# EAGLE board Nava_v1.02 (EAGLE 6.1), part 1 of 5
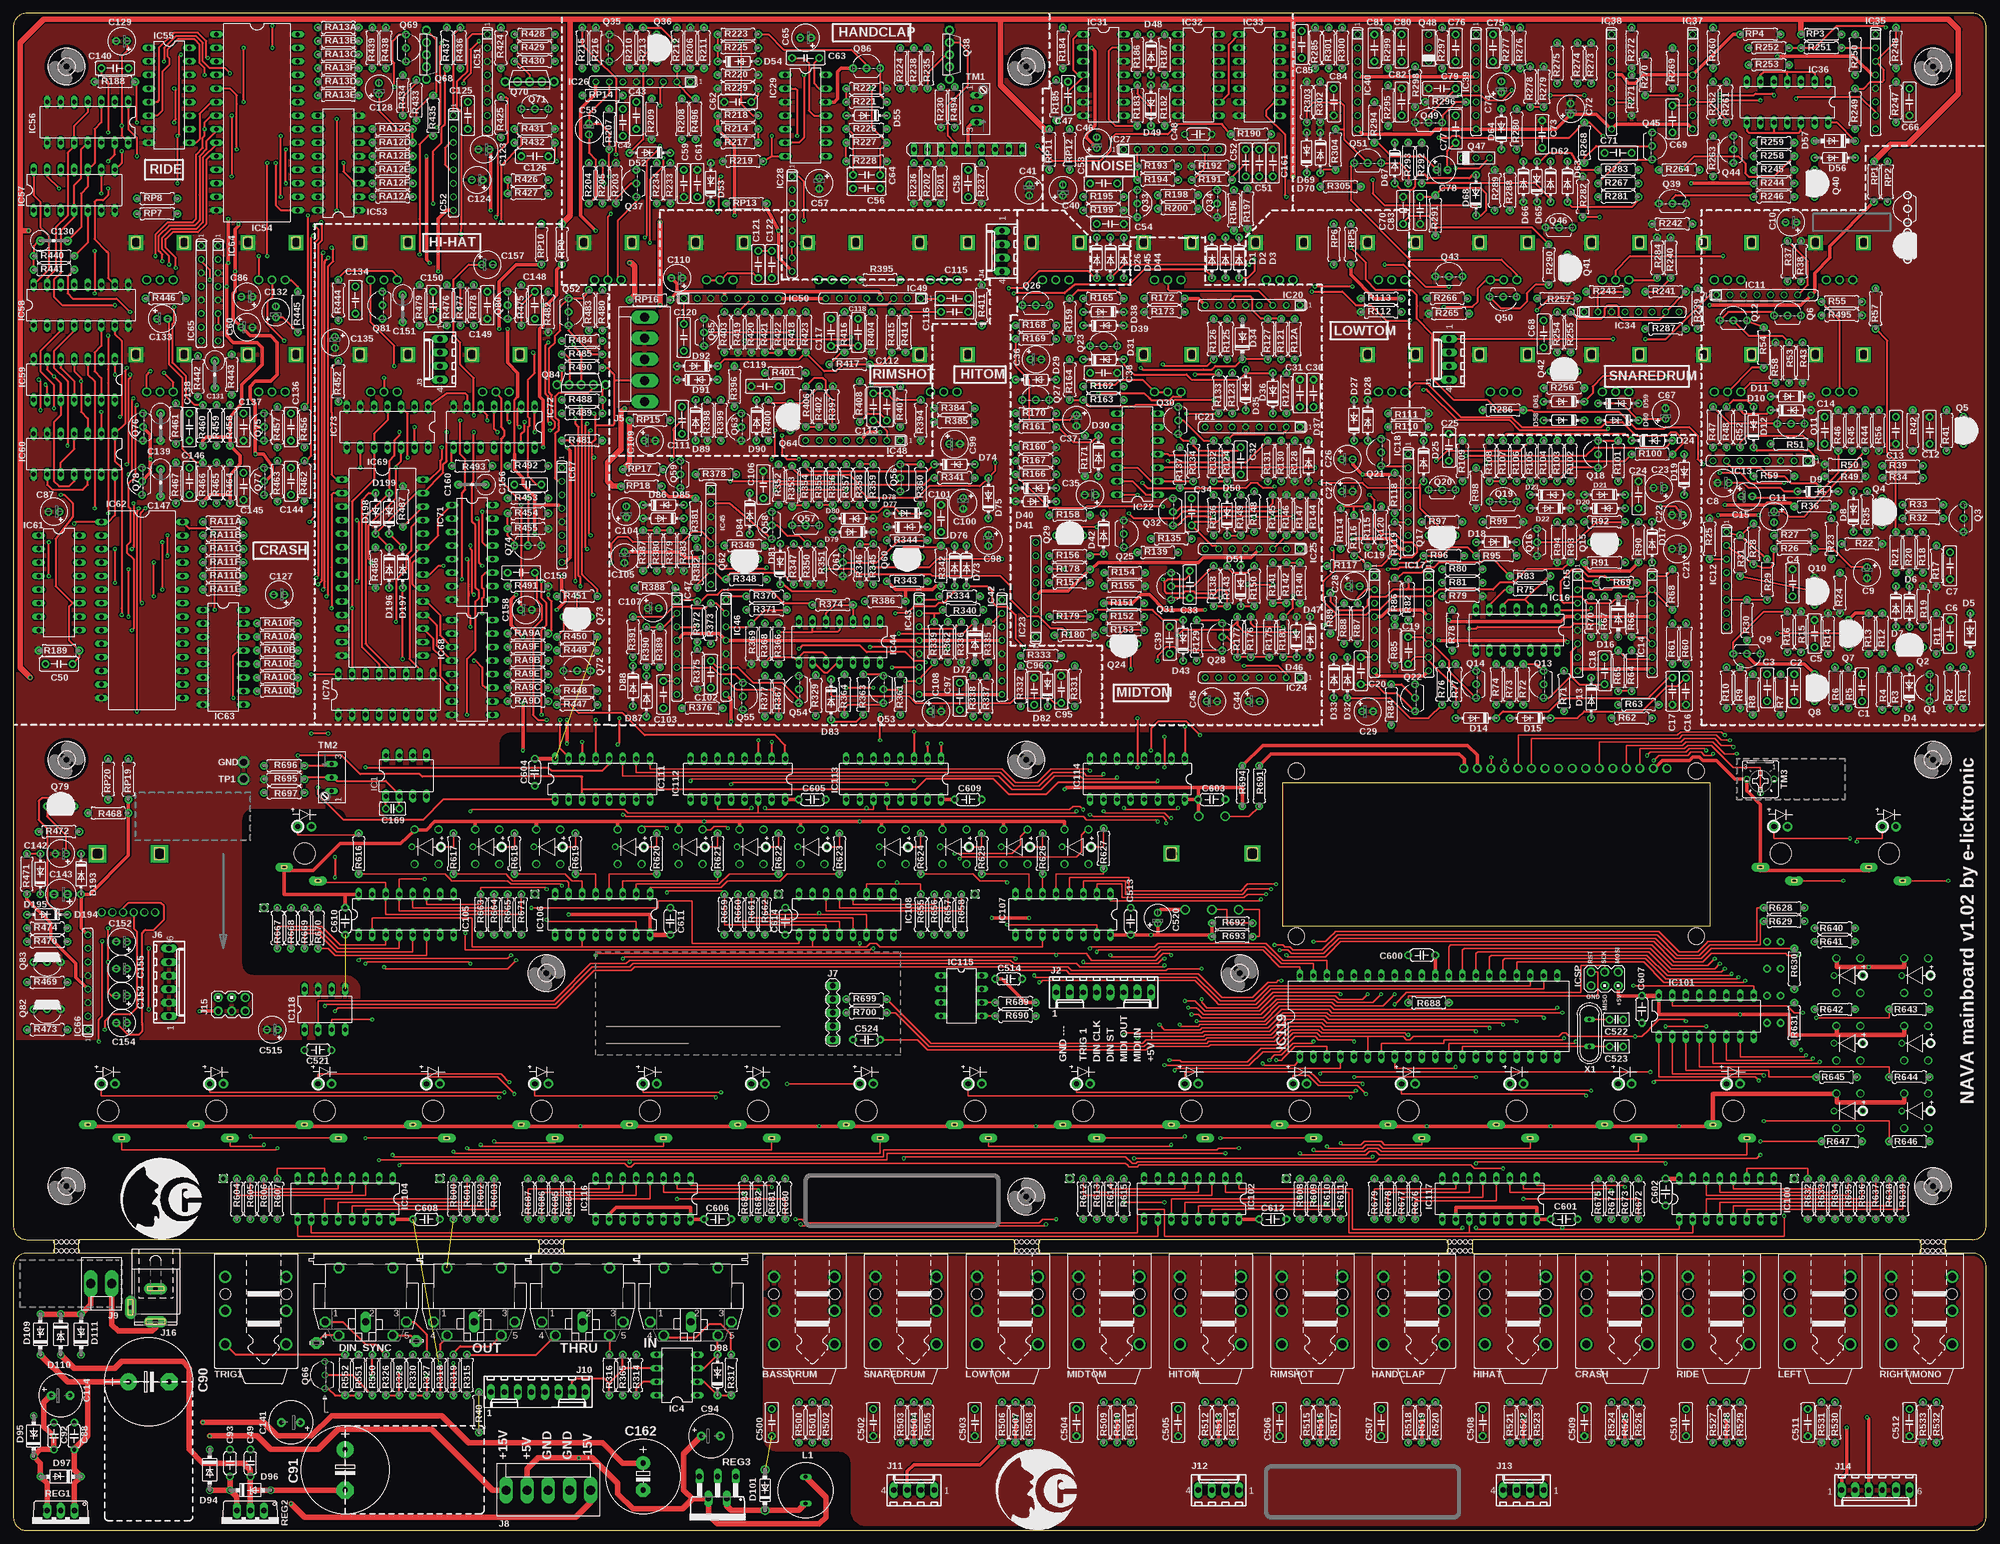
[diagram p15: board, top side]
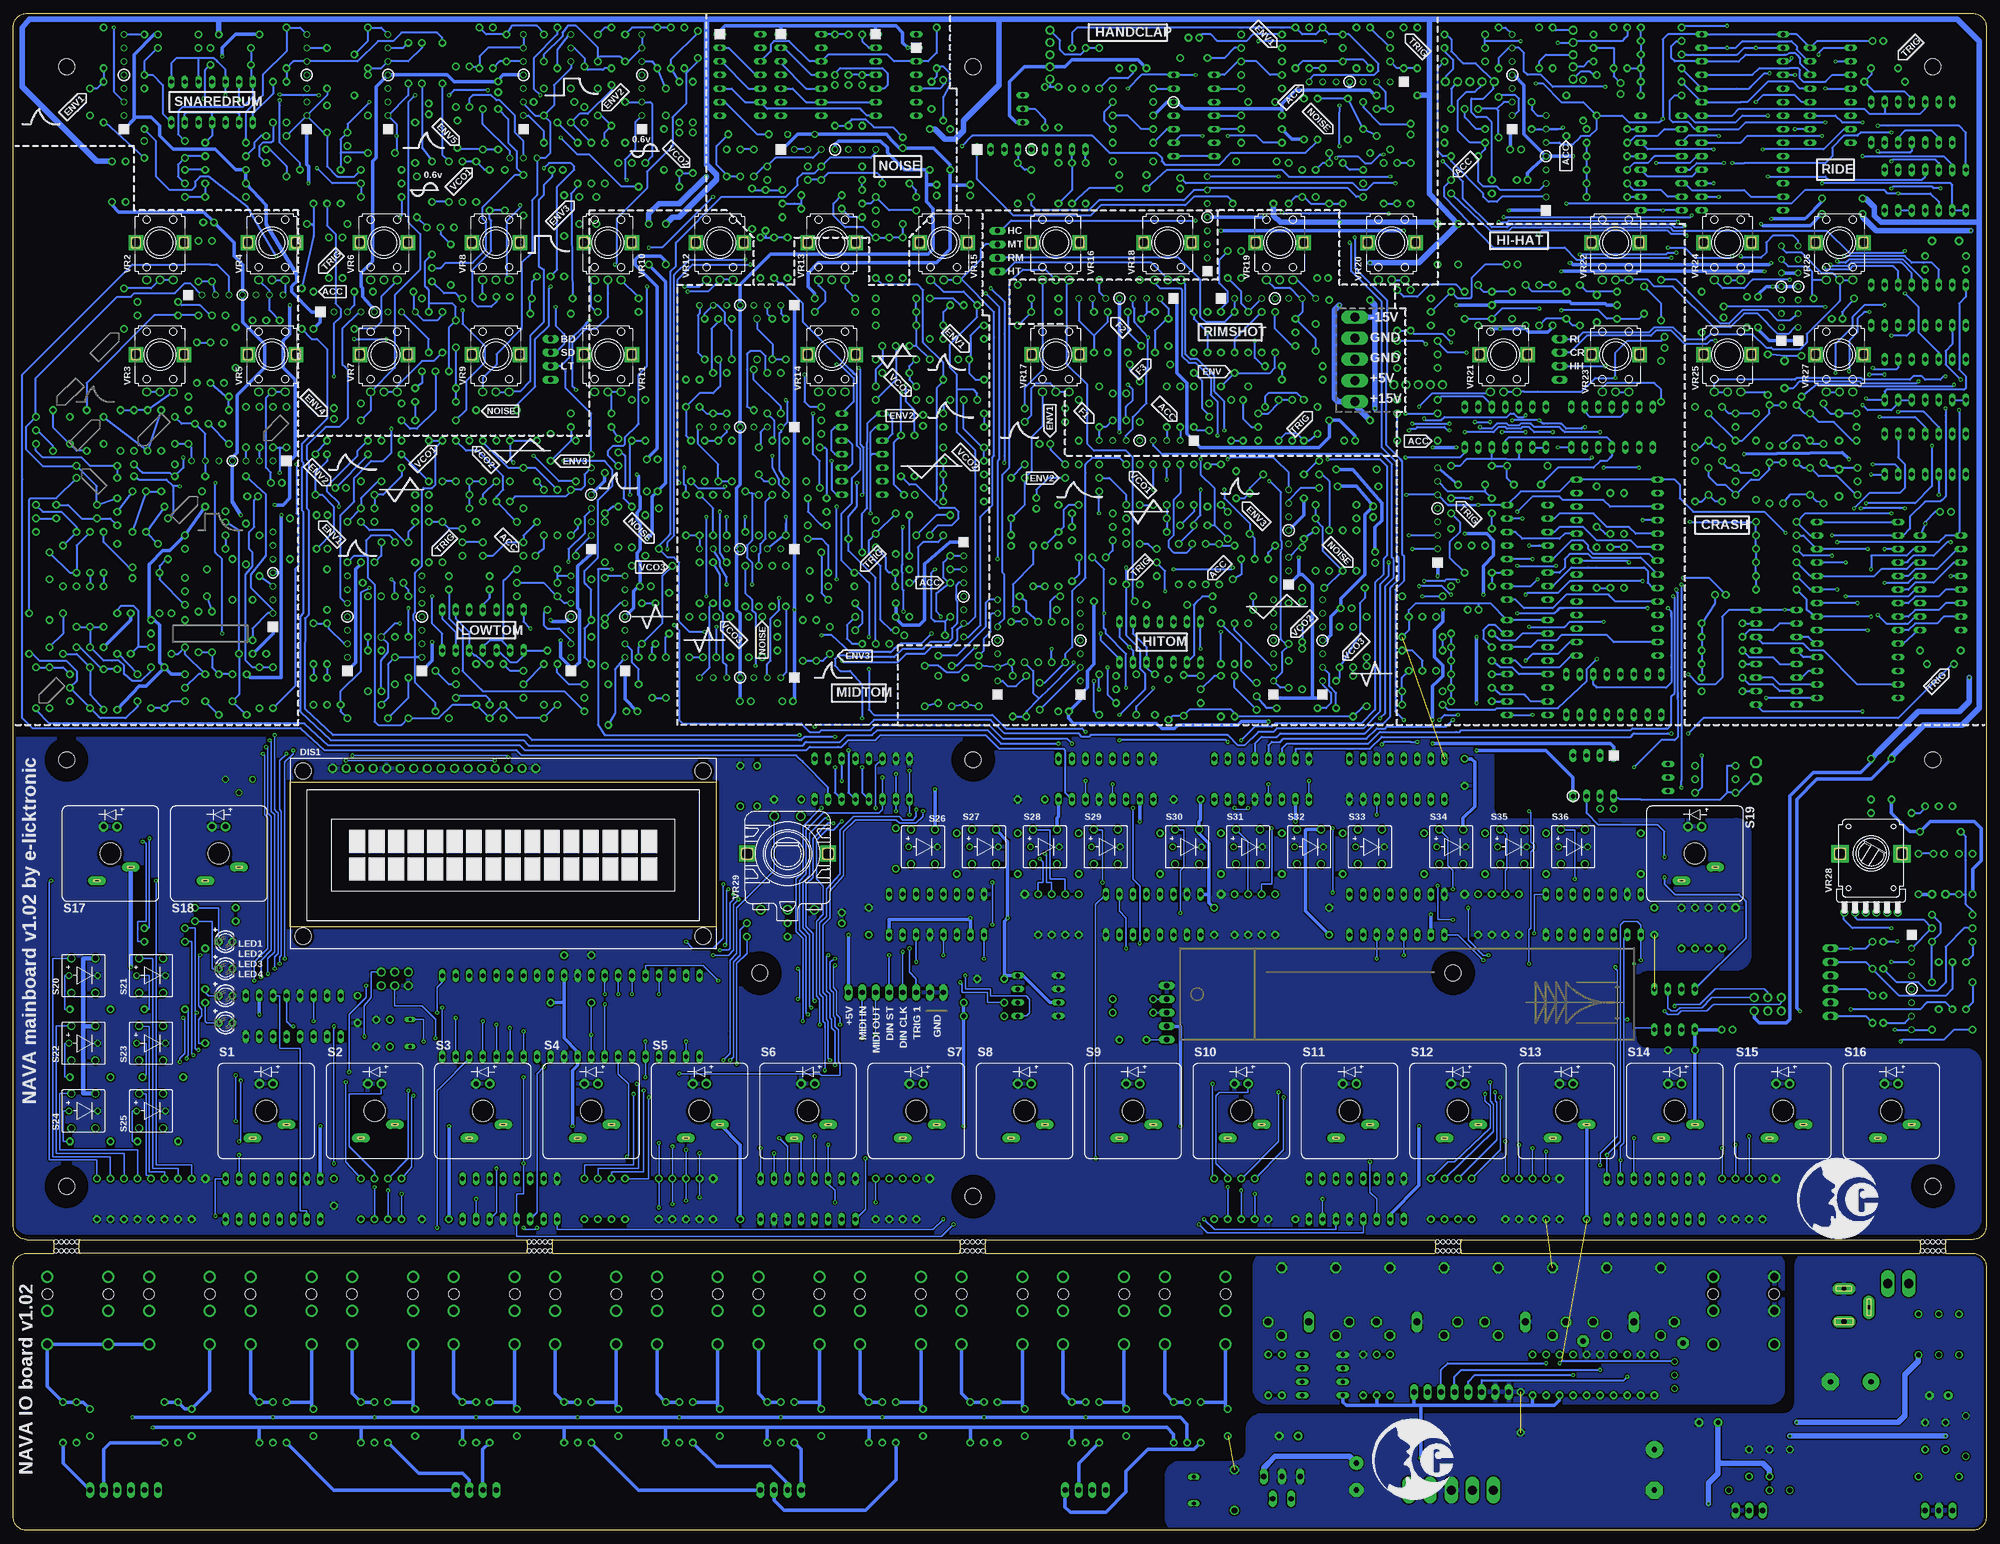
[diagram p16: board, bottom side, seen from below]

Size 370 x 284.55 mm. Coordinates in mm from the lower left corner, seen from the top.
Outline: 0,57.09 arc90 2.54,54.55 7.45,54.55 arc-90 7.7,54.3 7.7,52.25 arc-90 7.45,52 2.54,52 arc90 0,49.46 0,2.54 arc90 2.54,0 367.46,0 arc90 370,2.54 370,49.46 arc90 367.46,52 362.55,52 arc-90 362.3,52.25 362.3,54.3 arc-90 362.55,54.55 367.46,54.55 arc90 370,57.09 370,282.01 arc90 367.46,284.55 2.54,284.55 arc90 0,282.01 0,57.09
Outline: 98.35,54.55 12.55,54.55 arc90 12.3,54.3 12.3,52.25 arc90 12.55,52 98.35,52 arc90 98.6,52.25 98.6,54.3 arc90 98.35,54.55
Outline: 187.55,54.55 103.45,54.55 arc90 103.2,54.3 103.2,52.25 arc90 103.45,52 187.55,52 arc90 187.8,52.25 187.8,54.3 arc90 187.55,54.55
Outline: 268.75,54.55 192.65,54.55 arc90 192.4,54.3 192.4,52.25 arc90 192.65,52 268.75,52 arc90 269,52.25 269,54.3 arc90 268.75,54.55
Outline: 357.45,54.55 273.85,54.55 arc90 273.6,54.3 273.6,52.25 arc90 273.85,52 357.45,52 arc90 357.7,52.25 357.7,54.3 arc90 357.45,54.55
Outline: 318.13,113.29 238.12,113.29 238.12,140.28 318.13,140.28 318.13,113.29
Copper layers (1*16): Top 0.035mm / dielectric 1.5mm / Bottom 0.035mm
Design rules: minimum track width 10mil, minimum drill 10mil, track to track 8mil, track to pad 8mil, pad to pad 8mil, via to via 8mil, smd to smd 8mil, copper to edge 20mil, drill to drill 8mil, minimum pad ring 8mil, minimum via ring 8mil, stop-mask expansion 4mil, vias tented up to drill 24mil, thermal gap 10mil
Net classes: 0 default: width 0.381 mm, drill 0.254 mm, clearance 0.254 mm; 1 GND: width 0.762 mm, drill 0.254 mm, clearance 0.381 mm; 2 power: width 0.61 mm, drill 0.254 mm, clearance 0.381 mm; 3 special: width 0.254 mm, drill 0.254 mm, clearance 0.254 mm; 4 NOISE: width 0.381 mm, drill 0.254 mm, clearance 0.508 mm; 5 isolate: width 0.381 mm, drill 0.254 mm, clearance 1.016 mm
Holes 0.8 mm at 8,54.15 9,54.15 10,54.15 11,54.15 12,54.15 8,52.45 9,52.45 10,52.45 11,52.45 12,52.45 188.1,54.15 189.1,54.15 190.1,54.15 191.1,54.15 192.1,54.15 188.1,52.45 189.1,52.45 190.1,52.45 191.1,52.45 192.1,52.45 358,54.15 359,54.15 360,54.15 361,54.15 362,54.15 358,52.45 359,52.45 360,52.45 361,52.45 362,52.45 269.3,54.15 270.3,54.15 271.3,54.15 272.3,54.15 273.3,54.15 269.3,52.45 270.3,52.45 271.3,52.45 272.3,52.45 273.3,52.45 98.9,54.15 99.9,54.15 100.9,54.15 101.9,54.15 102.9,54.15 98.9,52.45 99.9,52.45 100.9,52.45 101.9,52.45 102.9,52.45

## Footprints (pad centres in the part's own frame; a part is rotated, then mirrored left to right if it is on the bottom)
LSP10 = drill 1.016 pad 2.159 octagon: MP 0,0
JACK_TRS = drill 1.5: R -7.23,6.35; RN 4.2,6.35; S -7.23,12.7; SN 4.2,12.7; T -7.23,0; TN 4.2,0 | hole 2: -7.23,9.5; 4.2,9.5
C050-025X075 = drill 0.813 pad 1.422: 1 -2.54,0; 2 2.54,0
E2-5 = drill 0.813 pad 1.422: + -1.016,0; - 1.016,0
C050-024X044 = drill 0.813 octagon: 1 -2.54,0; 2 2.54,0
C050-024X044' = drill 0.813 pad 1.422: 1 -2.54,0; 2 2.54,0
E7,5-16 = drill 1.016 pad 3.15: + -3.81,0 | drill 1.016 pad 3.15 octagon: - 3.81,0
E3,5-8 = drill 0.813 pad 1.6: + -1.778,0 | drill 0.813 pad 1.6 octagon: - 1.778,0
C025_RE = drill 0.813 pad 1.575: + -2.54,0; - 2.54,0
E2,5-6 = drill 0.813 pad 1.6: + -1.27,0 | drill 0.813 pad 1.6 octagon: - 1.27,0
E5-13 = drill 1.016 pad 2.54: + -2.54,0 | drill 1.016 pad 2.54 octagon: - 2.54,0
C025-025X050 = drill 0.813 pad 1.422: 1 -1.27,0; 2 1.27,0
DO35-7C = drill 0.813 pad 1.422: A 3.81,0; C -3.81,0
DO41-7 = drill 0.9: A 3.81,0; C -3.81,0
DO41-7.6 = drill 1.1 pad 1.7: A 3.81,0; C -3.81,0
MAB5SH = drill 1.321 octagon: 1 7.62,5.08; 3 -7.62,5.08; 4 5.08,7.62; 5 -5.08,7.62; PE -5.08,-5.08; PE@ 5.08,-5.08 | drill 1.321 long: 2 0,5.08
TUXGR_16X2_R2 = drill 1 pad 1.676: 1 -32,16; 2 -29.46,16; 3 -26.92,16; 4 -24.38,16; 5 -21.84,16; 6 -19.3,16; 7 -16.76,16; 8 -14.22,16; 9 -11.68,16; 10 -9.14,16; 11 -6.6,16; 12 -4.06,16; 13 -1.52,16; 14 1.02,16; 15 3.56,16; 16 6.1,16 | hole 3.1: -37.5,-15.5; 37.5,-15.5; -37.5,15.5; 37.5,15.5
1,6/0,8 = drill 0.813 pad 1.6 octagon: 1 0,0
P1-13 = drill 1.321 pad 2.159 octagon: TP 0,0
DIL08 = drill 0.813 pad 1.27 long: 1 -3.81,-3.81; 2 -1.27,-3.81; 3 1.27,-3.81; 4 3.81,-3.81; 5 3.81,3.81; 6 1.27,3.81; 7 -1.27,3.81; 8 -3.81,3.81
DIL08' = drill 0.813 long: 1 -3.81,-3.81; 2 -1.27,-3.81; 3 1.27,-3.81; 4 3.81,-3.81; 5 3.81,3.81; 6 1.27,3.81; 7 -1.27,3.81; 8 -3.81,3.81
SIL8 = drill 0.813: 1 -8.89,0; 2 -6.35,0; 3 -3.81,0; 4 -1.27,0; 5 1.27,0; 6 3.81,0; 7 6.35,0; 8 8.89,0
DIL14 = drill 0.813 long: 1 -7.62,-3.81; 2 -5.08,-3.81; 3 -2.54,-3.81; 4 0,-3.81; 5 2.54,-3.81; 6 5.08,-3.81; 7 7.62,-3.81; 8 7.62,3.81; 9 5.08,3.81; 10 2.54,3.81; 11 0,3.81; 12 -2.54,3.81; 13 -5.08,3.81; 14 -7.62,3.81
SIL09 = drill 0.8 long: 1 10.16,0; 2 7.62,0; 3 5.08,0; 4 2.54,0; 5 0,0; 6 -2.54,0; 7 -5.08,0; 8 -7.62,0; 9 -10.16,0
DIL16 = drill 0.813 long: 1 -8.89,-3.81; 2 -6.35,-3.81; 3 -3.81,-3.81; 4 -1.27,-3.81; 5 1.27,-3.81; 6 3.81,-3.81; 7 6.35,-3.81; 8 8.89,-3.81; 9 8.89,3.81; 10 6.35,3.81; 11 3.81,3.81; 12 1.27,3.81; 13 -1.27,3.81; 14 -3.81,3.81; 15 -6.35,3.81; 16 -8.89,3.81
DIL28-6 = drill 0.813 long: 1 -16.51,-7.62; 2 -13.97,-7.62; 3 -11.43,-7.62; 4 -8.89,-7.62; 5 -6.35,-7.62; 6 -3.81,-7.62; 7 -1.27,-7.62; 8 1.27,-7.62; 9 3.81,-7.62; 10 6.35,-7.62; 11 8.89,-7.62; 12 11.43,-7.62; 13 13.97,-7.62; 14 16.51,-7.62; 15 16.51,7.62; 16 13.97,7.62; 17 11.43,7.62; 18 8.89,7.62; 19 6.35,7.62; 20 3.81,7.62; 21 1.27,7.62; 22 -1.27,7.62; 23 -3.81,7.62; 24 -6.35,7.62; 25 -8.89,7.62; 26 -11.43,7.62; 27 -13.97,7.62; 28 -16.51,7.62
DIL8 = drill 0.813 long: 1 -3.81,-3.81; 2 -1.27,-3.81; 3 1.27,-3.81; 4 3.81,-3.81; 5 3.81,3.81; 6 1.27,3.81; 7 -1.27,3.81; 8 -3.81,3.81
DIL40 = drill 0.813 long: 1 -24.13,-7.62; 2 -21.59,-7.62; 3 -19.05,-7.62; 4 -16.51,-7.62; 5 -13.97,-7.62; 6 -11.43,-7.62; 7 -8.89,-7.62; 8 -6.35,-7.62; 9 -3.81,-7.62; 10 -1.27,-7.62; 11 1.27,-7.62; 12 3.81,-7.62; 13 6.35,-7.62; 14 8.89,-7.62; 15 11.43,-7.62; 16 13.97,-7.62; 17 16.51,-7.62; 18 19.05,-7.62; 19 21.59,-7.62; 20 24.13,-7.62; 21 24.13,7.62; 22 21.59,7.62; 23 19.05,7.62; 24 16.51,7.62; 25 13.97,7.62; 26 11.43,7.62; 27 8.89,7.62; 28 6.35,7.62; 29 3.81,7.62; 30 1.27,7.62; 31 -1.27,7.62; 32 -3.81,7.62; 33 -6.35,7.62; 34 -8.89,7.62; 35 -11.43,7.62; 36 -13.97,7.62; 37 -16.51,7.62; 38 -19.05,7.62; 39 -21.59,7.62; 40 -24.13,7.62
MA03-2 = drill 1.016 pad 1.676: 1 -2.54,-1.27; 2 -2.54,1.27; 3 0,-1.27; 4 0,1.27; 5 2.54,-1.27; 6 2.54,1.27
6410-04 = drill 1.016 long: 1 3.81,0; 2 1.27,0; 3 -1.27,0; 4 -3.81,0
6410-08 = drill 1.016 long: 1 8.89,0; 2 6.35,0; 3 3.81,0; 4 1.27,0; 5 -1.27,0; 6 -3.81,0; 7 -6.35,0; 8 -8.89,0
KK-156-5 = drill 1.7 pad 2.184 long: 1 -7.92,0; 2 -3.96,0; 3 0,0; 4 3.96,0; 5 7.92,0
6410-06 = drill 1.016 long: 1 6.35,0; 2 3.81,0; 3 1.27,0; 4 -1.27,0; 5 -3.81,0; 6 -6.35,0
MA05-1A = drill 1.016 long: 1 -5.08,0; 2 -2.54,0; 3 0,0; 4 2.54,0; 5 5.08,0
KK-156-2 = drill 1.7 pad 2.184 long: 1 -1.98,0; 2 1.98,0
JACK_PSU_2.1MM = drill 0.8 pad 2.184 long: 1 -3.5,0; 2 0,-4.7 | drill 1 pad 2.184 long: 3 2.7,0
BS11 = drill 0.7 long: 1 -2.5,0; 2 2.5,0
LED3MM = drill 0.813 pad 1.422: A -1.27,0; K 1.27,0
TO92-ECB = drill 0.813 pad 1.422: B 2.54,0; C 0,0; E -2.54,0
TO92-ECB-PNP = drill 0.813 pad 1.422: B 2.54,0; C 0,0; E -2.54,0
SIP-5 = drill 1 pad 1.676: 1 -4.572,0; 2 -2.286,0; 3 0,0; 4 2.286,0; 5 4.572,0
TO-3 = drill 0.813: B 2.54,0; C 0,0; E -2.54,0
TO92-EBC-SMALL = drill 0.813: B 0,0; C -2.54,0; E 2.54,0
0207/7 = drill 0.813 pad 1.422: 1 -3.81,0; 2 3.81,0
TO220V = drill 1.016 long: 1 -2.54,-2.54; 2 0,-2.54; 3 2.54,-2.54
T05D = drill 1.016 long: 1 -3.404,-5.08; 2 -1.702,-0.914; 3 0,-5.08; 4 1.702,-0.914; 5 3.404,-5.08
MX1A-SW = drill 0.5 pad 1.676 long: 1 -2.54,-5.08; 2 3.81,-2.54 | drill 1 pad 1.778: A 1.27,5.08; K -1.27,5.08 | hole 3.95: 0,0
SPH_SW = drill 1: 1 -2.25,3.25; 2 -2.25,-3.25; 3 2.25,3.25; 4 2.25,-3.25 | drill 0.8: A -2.7,0; K 2.7,0
S64W = drill 0.813 long: A 2.54,1.27; E -2.54,1.27; S 0,1.27
B25P = drill 0.813 octagon: A -2.54,0; E 2.54,0; S 0,2.54
3,0 = hole 3: 0,0
EVUF = drill 1.1 pad 1.676: 1 -2.5,-7; 2 0,-7; 3 2.5,-7 | drill 1.6 pad 2.8 square: M1 4.5,0; M2 -4.5,0
PTV112-4 = drill 1: 1 -3,-11; 1' -1,-11; 2 -5,-11; 2' 1,-11; 3 5,-11; 3' 3,-11 | drill 2 pad 3.302 square: P$1 -5.8,0; P$2 5.8,0
PEC16_ENCODER = drill 1.2: A -5,-10.5; B 0,-10.5; C 5,-10.5; D -2.5,7; E 2.5,7 | drill 2 square: P$6 -7.6,0; P$7 7.6,0
QS = drill 0.61 long: 1 -2.54,0; 2 2.54,0

## Placement (x,y rotation side)
4  LSP10  [LSP10]  56.83,35.19 0 top
5  LSP10  [LSP10]  75.56,35.5 0 top
BASSDRUM  JACK_TRSNRJ6HF  [JACK_TRS]  149.86,34.87 0 top
C1  0.068  [C050-025X075]  346.71,158.06 90 top
C2  0.0033  [C050-025X075]  334.01,158.06 90 top
C3  0.0047  [C050-025X075]  328.93,158.06 270 top
C4  100p  [C050-025X075]  333.69,177.74 90 top
C5  0.0068  [C050-025X075]  337.82,168.22 270 top
C6  0.0022  [C050-025X075]  363.22,168.22 270 top
C7  0.033  [C050-025X075]  363.22,180.92 90 top
C8  0.33/50  [E2-5]  320.68,196.48 180 top
C9  0.33/50  [E2-5]  347.66,179.65 270 top
C10  10/16  [E2-5]  333.38,245.37 180 top
C11  0.47/50  [E2-5]  330.2,190.12 270 top
C12  0.033  [C050-025X075]  359.41,206.32 90 top
C13  0.1  [C050-025X075]  353.06,206.32 270 top
C14  0.033  [C050-025X075]  339.73,206.32 90 top
C15  0.47/50  [E2-5]  325.12,193.94 0 top
C16  0.1  [C050-025X075]  313.69,157.42 90 top
C17  0.047  [C050-025X075]  311.15,157.42 90 top
C18  0.022  [C050-025X075]  298.45,161.23 90 top
C19  0.033  [C050-025X075]  261.62,165.04 270 top
C20  0.012  [C050-025X075]  252.73,161.23 90 top
C21  0.68/10  [E2-5]  312.1,184.09 180 top
C22  0.22/10  [E2-5]  312.1,190.44 180 top
C23  0.68/10  [E2-5]  308.61,195.52 180 top
C24  0.01  [C050-025X075]  304.8,194.25 270 top
C25  0.056  [C050-025X075]  269.24,203.14 270 top
C26  10/16  [E2-5]  250.19,200.92 0 top
C27  10/16  [E2-5]  250.19,194.89 0 top
C28  10/16  [E2-5]  251.46,177.11 0 top
C29  10/16  [E2-5]  254,153.61 0 top
C30  0.1  [C050-025X075]  243.84,213.3 270 top
C31  0.047  [C050-025X075]  241.3,213.3 270 top
C32  0.018  [C050-025X075]  230.19,200.6 270 top
C33  0.027  [C050-025X075]  220.66,177.43 90 top
C34  0.01  [C050-025X075]  220.98,191.08 270 top
C35  0.47/50  [E2-5]  201.93,194.25 180 top
C36  0.15/10  [E2-5]  191.77,219.65 0 top
C37  0.47/50  [E2-5]  199.39,208.22 270 top
C38  0.0068  [C050-025X075]  204.47,217.11 180 top
C39  0.056  [C050-025X075]  216.85,166.95 270 top
C40  10/16  [E2-5]  196.85,251.4 90 top
C41  10/16  [E2-5]  190.5,251.4 270 top
C42  0.0047  [C050-025X075]  114.3,264.1 90 top
C43  0.0047  [C050-025X075]  116.84,265.37 270 top
C44  10/16  [E2-5]  232.73,155.52 0 top
C45  10/16  [E2-5]  224.79,155.52 0 top
C46  4.7/50  [E2-5]  203.2,260.29 90 top
C47  100p  [C050-025X075]  197.8,269.18 270 top
C48  0.1  [C050-024X044]  222.25,261.88 0 top
C49  0.1  [C050-024X044']  44.45,12.64 270 top
C50  100p  [C050-025X075]  8.57,162.5 0 top
C51  0.0047  [C050-025X075]  233.68,256.48 270 top
C52  0.0047  [C050-025X075]  231.14,256.48 90 top
C53  0.047  [C050-025X075]  204.47,252.67 0 top
C54  0.0047  [C050-025X075]  205.74,245.05 0 top
C55  0.47/50  [E2-5]  107.95,262.83 270 top
C56  0.022  [C050-025X075]  160.02,251.72 180 top
C57  0.47/50  [E2-5]  151.13,252.67 270 top
C58  0.001  [C050-025X075]  179.07,252.67 270 top
C59  0.1  [C050-025X075]  125.73,252.67 270 top
C60  10/16  [E2-5]  43.81,225.69 0 top
C61  0.1  [C050-025X075]  128.27,252.67 90 top
C62  0.027  [C050-025X075]  135.89,267.91 0 top
C63  220p  [C050-025X075]  148.59,276.17 180 top
C64  0.001  [C050-025X075]  160.02,254.26 0 top
C65  0.47/50  [E2-5]  148.59,279.98 180 top
C66  0.01  [C050-025X075]  355.6,267.91 270 top
C67  0.47/50  [E2-5]  309.88,209.49 90 top
C68  0.0068  [C050-025X075]  287.02,224.42 270 top
C69  0.01  [C050-025X075]  311.15,264.74 90 top
C70  0.0047  [C050-025X075]  260.67,247.59 270 top
C71  0.0068  [C050-025X075]  300.99,258.39 0 top
C72  10/16  [E2-5]  292.1,266.64 90 top
C73  470p  [C050-025X075]  286.7,261.88 270 top
C74  10/16  [E2-5]  279.08,270.77 90 top
C75  0.0022  [C050-025X075]  277.5,278.07 90 top
C76  0.0022  [C050-025X075]  270.51,278.07 270 top
C77  10p  [C050-025X075]  270.51,262.83 90 top
C78  0.47/50  [E2-5]  267.97,255.21 0 top
C79  0.01  [C050-025X075]  267.97,270.45 0 top
C80  0.022  [C050-025X075]  260.35,278.07 270 top
C81  0.0033  [C050-025X075]  255.27,278.07 270 top
C82  0.047  [C050-025X075]  260.35,267.91 270 top
C83  0.1  [C050-025X075]  263.84,247.59 90 top
C84  220p  [C050-025X075]  247.65,267.91 270 top
C85  0.015  [C050-025X075]  241.62,278.71 90 top
C86  10/16  [E2-5]  43.81,231.4 180 top
C87  10/16  [E2-5]  7.62,191.08 180 top
C88  0.1  [C050-024X044']  11.43,17.72 90 top
C90  2200/35  [E7,5-16]  25.4,27.88 0 top
C91  2200/35  [E7,5-16]  62.23,11.37 270 top
C92  0.1  [C050-024X044']  7.62,17.72 90 top
C93  0.1  [C050-024X044']  40.64,12.64 270 top
C94  220/35  [E3,5-8]  130.81,17.72 0 top
C95  0.1  [C050-025X075]  196.53,157.74 270 top
C96  0.047  [C050-025X075]  191.45,157.42 270 top
C97  0.015  [C050-025X075]  177.48,156.47 90 top
C98  0.47/50  [E2-5]  182.88,185.68 270 top
C99  0.15/10  [E2-5]  176.53,203.78 0 top
C100  0.47/50  [E2-5]  178.12,192.67 270 top
C101  0.0056  [C050-025X075]  173.99,189.81 270 top
C102  0.022  [C050-025X075]  130.81,160.6 270 top
C103  0.0082  [C050-025X075]  121.92,156.79 90 top
C104  10/16  [E2-5]  114.94,191.08 90 top
C105  10/16  [E2-5]  114.62,182.5 270 top
C106  0.047  [C050-025X075]  140.65,196.16 270 top
C107  10/16  [E2-5]  120.02,172.98 0 top
C108  10/16  [E2-5]  173.04,153.61 0 top
C109  10/16  [E2-5]  119.38,204.41 0 top
C110  10/16  [E2-5]  124.46,234.89 180 top
C111  0.018  [C050-025X075]  125.41,208.22 270 top
C112  0.01  [C050-025X075]  163.83,210.76 270 top
C113  0.01  [C050-025X075]  161.29,210.76 90 top
C114  100/35  [E3,5-8]  8.89,25.34 0 top
C115  0.027  [C050-025X075]  176.53,231.08 180 top
C116  0.027  [C050-025X075]  176.53,228.54 0 top
C117  0.0047  [C050-025X075]  153.35,224.73 90 top
C118  0.0047  [C050-025X075]  158.43,224.73 270 top
C119  0.047  [C050-025X075]  140.97,214.57 180 top
C120  220p  [C050-025X075]  125.73,223.78 90 top
C121  0.01  [C050-025X075]  139.7,237.43 90 top
C122  0.01  [C050-025X075]  142.24,237.43 270 top
C123  10/16  [E2-5]  88.27,259.02 180 top
C124  10/16  [E2-5]  87,253.31 180 top
C125  0.001  [C050-025X075]  85.25,265.37 90 top
C126  0.001  [C050-025X075]  97.79,257.75 0 top
C127  10/16  [E2-5]  49.85,175.52 180 top
C128  10/16  [E2-5]  68.58,270.45 90 top
C129  10/16  [E2-5]  20.32,279.34 180 top
C130  470p  [C025_RE]  7.62,241.88 0 top
C131  470p  [C025_RE]  37.78,216.8 270 top
C132  10/16  [E2-5]  49.21,228.54 90 top
C133  10/16  [E2-5]  27.94,227.27 0 top
C134  0.01  [C050-025X075]  64.14,230.77 270 top
C135  1/50  [E2-5]  60.33,222.83 270 top
C136  0.0012  [C050-025X075]  52.07,206.95 270 top
C137  0.001  [C050-025X075]  43.18,206.95 90 top
C138  0.0027  [C050-025X075]  33.02,206.95 270 top
C139  390p  [C025_RE]  27.62,206.95 270 top
C140  100p  [C050-025X075]  19.05,274.26 0 top
C141  100/35  [E3,5-8]  52.07,20.26 180 top
C142  10/16  [E2-5]  8.89,126.94 180 top
C143  47/35  [E2,5-6]  8.89,119.32 180 top
C144  0.0012  [C050-025X075]  52.07,196.79 270 top
C145  0.001  [C050-025X075]  43.18,195.84 90 top
C146  0.0027  [C050-025X075]  33.02,196.79 270 top
C147  390p  [C025_RE]  27.62,196.48 270 top
C148  0.0012  [C050-025X075]  97.79,229.81 90 top
C149  0.001  [C050-025X075]  88.9,229.81 90 top
C150  0.0027  [C050-025X075]  78.74,229.81 270 top
C151  390p  [C025_RE]  73.03,229.18 270 top
C152  10/16  [E2-5]  20.32,110.43 180 top
C153  1/50  [E2-5]  20.32,100.27 180 top
C154  1/50  [E2-5]  20.32,95.19 180 top
C155  10/16  [E2-5]  20.32,105.35 180 top
C156  0.001  [C050-025X075]  96.52,196.16 180 top
C157  10/16  [E2-5]  88.9,237.43 0 top
C158  10/16  [E2-5]  96.2,172.66 0 top
C159  100p  [C050-025X075]  95.25,179.65 180 top
C160  470p  [C025_RE]  86.04,196.16 180 top
C161  0.0047  [C050-025X075]  236.22,256.48 90 top
C162  680/35  [E5-13]  118.11,10.1 270 top
C169  47p  [C025-025X050]  71.12,135.36 180 top
C500  0.01  [C050-025X075]  142.24,20.26 90 top
C502  0.01  [C050-025X075]  161.29,20.26 90 top
C503  0.01  [C050-025X075]  180.34,20.26 90 top
C504  0.01  [C050-025X075]  199.39,20.26 90 top
C505  0.01  [C050-025X075]  218.44,20.26 90 top
C506  0.01  [C050-025X075]  237.49,20.26 90 top
C507  0.01  [C050-025X075]  256.54,20.26 90 top
C508  0.01  [C050-025X075]  275.59,20.26 90 top
C509  0.01  [C050-025X075]  294.64,20.26 90 top
C510  0.01  [C050-025X075]  313.69,20.26 90 top
C511  0.01  [C050-025X075]  336.55,20.26 90 top
C512  0.01  [C050-025X075]  355.6,20.26 90 top
C513  0.1  [C050-024X044']  209.55,114.24 270 top
C514  0.1  [C050-024X044']  186.69,103.45 0 top
C515  100/10  [E2-5]  48.58,93.92 180 top
C520  100/10  [E2-5]  214.63,114.88 90 top
C521  0.1  [C050-024X044']  57.15,90.11 180 top
C522  22p  [C025-025X050]  300.67,95.83 180 top
C523  22p  [C025-025X050]  300.67,90.75 180 top
C524  0.1  [C050-024X044']  160.02,92.02 180 top
C600  0.1  [C050-024X044']  264.16,107.89 0 top
C601  0.1  [C050-024X044']  290.83,58.36 180 top
C602  0.1  [C050-024X044']  309.88,63.44 90 top
C603  0.1  [C050-024X044']  224.79,137.1 180 top
C604  0.1  [C050-024X044']  97.79,142.18 90 top
C605  0.1  [C050-024X044']  149.86,137.1 180 top
C606  0.1  [C050-024X044']  132.08,58.36 180 top
C607  0.1  [C050-024X044']  305.44,97.73 90 top
C608  0.1  [C050-024X044']  77.47,58.36 180 top
C609  0.1  [C050-024X044']  179.07,137.1 180 top
C610  0.1  [C050-024X044']  62.23,114.24 90 top
C611  0.1  [C050-024X044']  123.19,114.24 270 top
C612  0.1  [C050-024X044']  236.22,58.36 180 top
C614  0.1  [C050-024X044']  144.78,114.24 90 top
CRASH  JACK_TRSNRJ6HF  [JACK_TRS]  302.26,34.87 0 top
D1  1N4148"  [DO35-7C]  229.87,238.7 270 top
D2  1N4148"  [DO35-7C]  227.33,238.7 270 top
D3  1N4148"  [DO35-7C]  224.79,238.7 270 top
D4  1N4148"  [DO35-7C]  355.6,158.06 90 top
D5  1N4148"  [DO35-7C]  367.03,168.22 90 top
D6  1N4148"  [DO35-7C]  355.6,173.3 270 top
D7  1N4148"  [DO35-7C]  353.06,173.3 270 top
D8  1N4148"  [DO35-7C]  345.12,191.08 90 top
D9  1N4148"  [DO35-7C]  338.45,194.89 0 top
D10  1N4148"  [DO35-7C]  333.38,210.13 0 top
D11  1N4148"  [DO35-7C]  333.38,212.67 180 top
D12  1N4148"  [DO35-7C]  326.39,206.95 90 top
D13  1N4148"  [DO35-7C]  295.91,156.15 270 top
D14  1N4148"  [DO35-7C]  274.32,152.34 180 top
D15  1N4148"  [DO35-7C]  284.48,152.34 180 top
D16  [DO41-7]  300.99,171.39 270 top
D17  1N4148"  [DO35-7C]  307.34,185.36 270 top
D18  1N4148"  [DO35-7C]  278.13,185.36 180 top
D19  1N4148"  [DO35-7C]  313.37,198.06 90 top
D20  1N4148"  [DO35-7C]  298.45,191.71 0 top
D21  1N4148"  [DO35-7C]  298.45,194.25 180 top
D22  1N4148"  [DO35-7C]  288.29,191.71 180 top
D23  1N4148"  [DO35-7C]  288.29,194.25 0 top
D24  1N4148"  [DO35-7C]  307.34,204.41 0 top
D25  1N4148"  [DO35-7C]  264.48,200.6 270 top
D26  1N4148"  [DO35-7C]  203.2,238.7 270 top
D27  1N4148"  [DO35-7C]  251.46,208.22 90 top
D28  1N4148"  [DO35-7C]  254,208.22 270 top
D29  1N4148"  [DO35-7C]  191.77,215.84 0 top
D30  1N4148"  [DO35-7C]  203.52,201.56 270 top
D31  1N4148"  [DO35-7C]  204.47,219.65 0 top
D32  1N4148"  [DO35-7C]  250.19,159.96 270 top
D33  1N4148"  [DO35-7C]  247.65,159.96 270 top
D34  [DO41-7]  230.5,223.46 90 top
D35  1N4148"  [DO35-7C]  231.14,213.94 90 top
D36  1N4148"  [DO35-7C]  236.22,213.3 90 top
D37  1N4148"  [DO35-7C]  242.89,200.6 270 top
D38  1N4148"  [DO35-7C]  204.47,228.54 180 top
D39  1N4148"  [DO35-7C]  204.47,226 0 top
D40  1N4148"  [DO35-7C]  191.77,195.52 0 top
D41  1N4148"  [DO35-7C]  191.77,192.98 180 top
D42  1N4148"  [DO35-7C]  204.47,186.95 270 top
D43  1N4148"  [DO35-7C]  219.39,166.95 90 top
D44  1N4148"  [DO35-7C]  208.28,238.7 270 top
D45  1N4148"  [DO35-7C]  205.74,238.7 270 top
D46  1N4148"  [DO35-7C]  240.66,167.58 90 top
D47  1N4148"  [DO35-7C]  243.21,167.58 270 top
D48  1N4148"  [DO35-7C]  213.36,276.8 270 top
D49  1N4148"  [DO35-7C]  213.36,267.28 90 top
D50  1N4148"  [DO35-7C]  227.65,190.44 90 top
D51  1N4148"  [DO35-7C]  230.19,177.11 90 top
D52  1N4148"  [DO35-7C]  119.38,258.39 180 top
D53  1N4148"  [DO35-7C]  130.81,252.67 90 top
D54  1N4148"  [DO35-7C]  135.89,275.53 0 top
D55  1N4148"  [DO35-7C]  160.02,265.37 180 top
D56  1N4148"  [DO35-7C]  341.63,257.44 180 top
D57  [DO41-7]  341.63,260.61 180 top
D58  1N4148"  [DO35-7C]  290.83,208.22 180 top
D59  1N4148"  [DO35-7C]  300.99,211.4 0 top
D60  1N4148"  [DO35-7C]  300.99,208.22 180 top
D61  1N4148"  [DO35-7C]  290.83,211.72 180 top
D62  1N4148"  [DO35-7C]  288.29,252.99 270 top
D63  1N4148"  [DO35-7C]  291.46,252.99 270 top
D64  1N4148"  [DO35-7C]  279.08,262.83 90 top
D65  1N4148"  [DO35-7C]  283.21,252.99 270 top
D66  1N4148"  [DO35-7C]  285.75,252.99 90 top
D67  1N4148"  [DO35-7C]  259.08,256.48 270 top
D68  1N4148"  [DO35-7C]  274.32,250.45 90 top
D69  1N4148"  [DO35-7C]  242.57,258.39 90 top
D70  1N4148"  [DO35-7C]  245.11,258.39 270 top
D72  [DO41-7]  180.34,166.63 270 top
D73  1N4148"  [DO35-7C]  178.75,180.92 270 top
D74  1N4148"  [DO35-7C]  176.53,199.97 0 top
D75  1N4148"  [DO35-7C]  182.88,193.62 90 top
D76  1N4148"  [DO35-7C]  176.53,180.92 270 top
D77  1N4148"  [DO35-7C]  167.64,188.22 0 top
D78  1N4148"  [DO35-7C]  167.64,190.76 180 top
D79  1N4148"  [DO35-7C]  157.48,187.27 180 top
D80  1N4148"  [DO35-7C]  157.48,189.81 0 top
D81  1N4148"  [DO35-7C]  143.83,181.24 90 top
D82  1N4148"  [DO35-7C]  193.99,158.38 90 top
D83  1N4148"  [DO35-7C]  153.35,155.84 270 top
D84  1N4148"  [DO35-7C]  138.11,190.76 270 top
D85  1N4148"  [DO35-7C]  121.92,189.81 180 top
D86  1N4148"  [DO35-7C]  121.92,192.35 0 top
D87  1N4148"  [DO35-7C]  118.75,156.47 270 top
D88  1N4148"  [DO35-7C]  116.2,158.38 270 top
D89  1N4148"  [DO35-7C]  127.95,208.22 270 top
D90  1N4148"  [DO35-7C]  139.38,208.22 270 top
D91  1N4148"  [DO35-7C]  128.27,215.84 0 top
D92  1N4148"  [DO35-7C]  128.27,218.38 180 top
D94  1N4004  [DO41-7]  36.83,11.37 270 top
D95  1N4004  [DO41-7]  3.81,17.72 90 top
D96  1N4004  [DO41-7]  44.45,7.56 0 top
D97  1N4004  [DO41-7]  8.89,10.1 180 top
D98  1N4148"  [DO35-7C]  132.08,29.15 90 top
D101  1N5819-B  [DO41-7.6]  140.97,7.56 90 top
D109  1N4004  [DO41-7]  5.08,36.77 90 top
D110  1N4004  [DO41-7]  8.89,36.77 270 top
D111  1N4004  [DO41-7]  12.7,36.77 90 top
D193  1N4148"  [DO35-7C]  12.7,123.13 270 top
D194  1N4148"  [DO35-7C]  6.35,115.51 180 top
D195  1N4148"  [DO35-7C]  5.08,123.13 90 top
D196  1N4148"  [DO35-7C]  70.48,180.6 270 top
D197  1N4148"  [DO35-7C]  73.03,180.6 270 top
D198  1N4148"  [DO35-7C]  67.94,190.76 90 top
D199  1N4148"  [DO35-7C]  70.48,190.76 90 top
DIN_SYNC  [MAB5SH]  66.1,44.18 180 top
DIS1  TUXGR_16X2_R2  [TUXGR_16X2_R2]  278.13,126.94 0 bottom
G1  [1,6/0,8]  39.37,65.98 0 top
G2  [1,6/0,8]  80.01,65.98 0 top
G3  [1,6/0,8]  198.12,65.98 0 top
G4  [1,6/0,8]  238.76,65.98 0 top
G5  [1,6/0,8]  334.01,65.98 0 top
G6  [1,6/0,8]  180.34,119.32 0 top
G7  [1,6/0,8]  143.51,119.32 0 top
G8  [1,6/0,8]  97.79,119.32 0 top
G9  [1,6/0,8]  46.99,116.78 0 top
GND  TPPAD1-13  [P1-13]  43.18,144.09 0 top
HANDCLAP  JACK_TRSNRJ6HF  [JACK_TRS]  264.16,34.87 0 top
HIHAT  JACK_TRSNRJ6HF  [JACK_TRS]  283.21,34.87 0 top
HITOM  JACK_TRSNRJ6HF  [JACK_TRS]  226.06,34.87 0 top
IC1  TL072P  [DIL08]  73.66,141.55 0 top
IC4  6N138"  [DIL08']  124.46,29.15 90 top
IC11  M5218  [SIL8]  328.3,231.72 0 top
IC12  M5218  [SIL8]  321.31,178.38 270 top
IC13  M5218  [SIL8]  327.66,200.6 180 top
IC14  M5218  [SIL8]  307.34,170.12 270 top
IC15  M5218  [SIL8]  293.37,170.12 270 top
IC16  4069UB  [DIL14]  281.94,168.85 180 top
IC17  M5218  [SIL8]  265.43,170.12 270 top
IC18  M5218  [SIL8]  261.62,192.98 270 top
IC19  M5218  [SIL8]  255.27,170.12 270 top
IC20  M5218  [SIL8]  232.41,229.81 180 top
IC21  M5218  [SIL8]  232.41,206.95 180 top
IC22  4069UB  [DIL14]  210.82,201.87 90 top
IC23  M5218  [SIL8]  191.77,176.47 90 top
IC24  M5218  [SIL8]  232.41,159.96 180 top
IC25  M5218  [SIL8]  232.41,184.09 180 top
IC26  M5218  [SIL8]  118.11,271.72 180 top
IC27  M5218  [SIL8]  217.17,259.02 0 top
IC28  M5218  [SIL8]  146.05,245.05 270 top
IC29  AN6912  [DIL14]  148.59,265.37 270 top
IC30  BA6110SIL  [SIL09]  179.07,259.02 180 top
IC31  4070N  [DIL14]  204.47,272.99 270 top
IC32  4006N  [DIL14]  222.25,272.99 270 top
IC33  4006N  [DIL14]  233.68,272.99 270 top
IC34  M5218  [SIL8]  303.53,228.54 0 top
IC35  M5218  [SIL8]  349.25,271.72 270 top
IC36  4069UB  [DIL14]  332.74,267.91 180 top
IC37  M5218  [SIL8]  314.96,271.72 270 top
IC38  M5218  [SIL8]  299.72,271.72 270 top
IC39  M5218  [SIL8]  274.32,271.72 270 top
IC40  M5218  [SIL8]  252.09,271.72 270 top
IC42  M5218  [SIL8]  185.42,165.68 270 top
IC43  M5218  [SIL8]  169.86,165.68 270 top
IC44  4069UB  [DIL14]  154.94,166.63 180 top
IC45  M5218  [SIL8]  130.81,186.31 270 top
IC46  M5218  [SIL8]  133.67,165.68 270 top
IC47  M5218  [SIL8]  124.46,165.68 270 top
IC48  M5218  [SIL8]  157.48,204.41 180 top
IC49  M5218  [SIL8]  161.29,231.08 180 top
IC50  M5218  [SIL8]  134.62,231.08 0 top
IC51  M5218  [SIL8]  88.9,271.72 270 top
IC52  M5218  [SIL8]  82.55,256.48 270 top
IC53  74HC174  [DIL16]  60.96,256.48 90 top
IC54  27C256P  [DIL28-6]  45.72,264.1 270 top
IC55  4040N  [DIL16]  29.21,269.18 270 top
IC56  4013N  [DIL14]  13.97,264.1 180 top
IC57  4011UB  [DIL14]  11.43,251.4 0 top
IC58  4520N  [DIL16]  12.7,229.81 0 top
IC59  4011UB  [DIL14]  11.43,215.84 180 top
IC60  4013N  [DIL14]  11.43,201.87 180 top
IC61  4040N  [DIL16]  8.57,177.74 270 top
IC62  27C256P  [DIL28-6]  24.13,172.66 270 top
IC63  74HC174  [DIL16]  39.37,163.77 270 top
IC64  M5218  [SIL8]  38.42,232.03 270 top
IC65  M5218  [SIL8]  35.24,232.03 270 top
IC66  M5218  [SIL8]  13.97,102.81 90 top
IC67  M5218  [SIL8]  102.87,190.44 270 top
IC68  74HC174  [DIL16]  86.04,161.87 270 top
IC69  27C256P  [DIL28-6]  69.22,180.6 270 top
IC70  4520N  [DIL16]  69.85,156.79 0 top
IC71  4040N  [DIL16]  86.04,183.46 270 top
IC72  4011UB  [DIL14]  90.17,206.95 180 top
IC73  4013N  [DIL14]  70.17,206.95 180 top
IC100  74HC165N  [DIL16]  321.31,62.17 0 top
IC101  74HC595N  [DIL16]  317.5,96.46 0 top
IC102  74HC165N  [DIL16]  220.98,62.17 180 top
IC104  74HC165N  [DIL16]  62.23,62.17 180 top
IC105  74HC165N  [DIL16]  73.66,115.51 0 top
IC106  74HC595N  [DIL16]  110.49,115.51 180 top
IC107  74HC595N  [DIL16]  196.85,115.51 180 top
IC108  74HC165N  [DIL16]  156.21,115.51 0 top
IC111  4051N  [DIL16]  110.49,140.91 0 top
IC112  74HC595N  [DIL16]  135.89,140.91 180 top
IC113  74HC595N  [DIL16]  165.1,140.91 180 top
IC114  4051N  [DIL16]  210.82,140.91 180 top
IC115  AT24CP  [DIL08']  177.8,100.27 270 top
IC116  74HC595N  [DIL16]  118.11,62.17 180 top
IC117  74HC595N  [DIL16]  276.86,62.17 180 top
IC118  MCP4822P  [DIL8]  58.42,97.73 0 top
IC119  ATMEGA1284P-20PU  [DIL40]  265.43,96.46 0 top
ICSP  [MA03-2]  298.45,103.45 180 top
IN  [MAB5SH]  127.06,44.18 180 top
J1  [6410-04]  269.24,219.65 90 top
J2  [6410-08]  204.47,100.91 180 top
J3  [6410-04]  80.01,219.65 90 top
J4  [6410-04]  185.42,239.97 90 top
J5  [KK-156-5]  118.43,219.65 90 top
J6  22-27-2061-06  [6410-06]  29.21,102.81 270 top
J7  [MA05-1A]  153.67,97.1 270 top
J8  [KK-156-5]  100.33,7.56 0 top
J9  [KK-156-2]  16.51,46.3 180 top
J10  [6410-08]  98.42,25.98 180 top
J11  [6410-04]  168.91,7.56 0 top
J12  [6410-04]  226.06,7.56 0 top
J13  [6410-04]  283.21,7.56 0 top
J14  22-27-2061-06  [6410-06]  349.25,7.56 180 top
J15  [MA03-2]  40.96,98.69 0 top
J16  [JACK_PSU_2.1MM]  26.67,41.85 270 top
L1  33u  [BS11]  148.59,7.56 270 top
LED1  [LED3MM]  330.2,110.43 0 bottom
LED2  [LED3MM]  330.2,105.35 0 bottom
LED3  [LED3MM]  330.2,100.27 0 bottom
LED4  [LED3MM]  330.2,95.19 0 bottom
LEFT  JACK_TRSNRJ6HF  [JACK_TRS]  340.36,34.87 0 top
LOWTOM  JACK_TRSNRJ6HF  [JACK_TRS]  187.96,34.87 0 top
MIDTOM  JACK_TRSNRJ6HF  [JACK_TRS]  207.01,34.87 0 top
OUT  [MAB5SH]  86.42,44.18 180 top
Q1  2SC2603  [TO92-ECB]  359.41,158.06 90 top
Q2  2SA1115  [TO92-ECB-PNP]  355.6,165.68 0 top
Q3  2SC2603  [TO92-ECB]  365.76,189.81 90 top
Q4  2SA1115  [TO92-ECB-PNP]  350.52,191.08 270 top
Q5  2SA1115  [TO92-ECB-PNP]  365.76,206.32 270 top
Q6  2SC2603  [TO92-ECB]  332.74,227.91 0 top
Q7  2SA1115  [TO92-ECB-PNP]  344.17,168.22 270 top
Q8  2SA1115  [TO92-ECB-PNP]  337.82,158.06 270 top
Q9  2SC2603  [TO92-ECB]  325.12,164.41 180 top
Q10  2SA1115  [TO92-ECB-PNP]  337.82,176.16 270 top
Q11  2SC2603  [TO92-ECB]  333.38,207.59 180 top
Q12  2SC2603  [TO92-ECB]  322.58,226.96 0 top
Q13  2SC2603  [TO92-ECB]  287.02,158.69 90 top
Q14  2SC2603  [TO92-ECB]  274.32,158.69 90 top
Q15  2SA1115  [TO92-ECB-PNP]  298.45,185.36 180 top
Q16  2SC2603  [TO92-ECB]  285.75,185.36 90 top
Q17  2SA1115  [TO92-ECB-PNP]  267.97,186.63 180 top
Q18  2SC2603  [TO92-ECB]  297.18,201.87 90 top
Q19  2SC2603  [TO92-ECB]  279.4,192.98 0 top
Q20  2SC2603  [TO92-ECB]  267.97,195.21 0 top
Q21  2SC2603  [TO92-ECB]  256.54,202.19 90 top
Q22  2SC2603  [TO92-ECB]  262.89,156.15 90 top
Q23  2SC2603  [TO92-ECB]  204.47,222.19 0 top
Q24  2SA1115  [TO92-ECB-PNP]  208.28,166.31 180 top
Q25  2SC2603  [TO92-ECB]  208.28,186.95 270 top
Q26  2SC2603  [TO92-ECB]  191.77,229.81 0 top
Q27  2SC2603  [TO92-ECB]  191.77,212.03 0 top
Q28  2SC2603  [TO92-ECB]  226.69,167.58 90 top
Q29  2SA1115  [TO92-ECB-PNP]  198.12,186.63 0 top
Q30  2SC2603  [TO92-ECB]  218.44,208.22 90 top
Q31  2SC2603  [TO92-ECB]  217.17,177.11 90 top
Q32  2SC2603  [TO92-ECB]  217.49,191.08 90 top
Q33  2SC2603  [TO92-ECB]  210.82,248.86 270 top
Q34  2SC2603  [TO92-ECB]  225.74,248.86 90 top
Q35  2SC2603  [TO92-ECB]  111.76,278.07 270 top
Q36  2SA1115  [TO92-ECB-PNP]  120.65,278.07 270 top
Q37  2SC2603  [TO92-ECB]  116.84,252.67 90 top
Q38  [SIP-5]  175.58,276.8 270 top
Q39  2SC2603  [TO92-ECB]  311.15,248.86 0 top
Q40  2SA1115  [TO92-ECB-PNP]  337.82,252.67 270 top
Q41  2SA1115  [TO92-ECB-PNP]  291.46,236.8 270 top
Q42  2SA1115  [TO92-ECB-PNP]  290.83,217.43 0 top
Q43  2SC2603  [TO92-ECB]  269.24,235.21 0 top
Q44  2SC2603  [TO92-ECB]  322.58,259.02 90 top
Q45  2SC2603  [TO92-ECB]  307.34,259.66 270 top
Q46  2SC2603  [TO92-ECB]  289.88,244.42 0 top
Q47  2SD1469  [TO-3]  274.32,257.44 0 top
Q48  2SD1469  [TO-3]  265.43,278.07 90 top
Q49  2SC2603  [TO92-ECB]  265.43,264.1 0 top
Q50  2SC2603  [TO92-ECB]  279.4,231.4 180 top
Q51  2SC2603  [TO92-ECB]  254,256.48 0 top
Q52  2SC2603  [TO92-ECB]  104.14,228.54 270 top
Q53  2SC2603  [TO92-ECB]  163.19,157.74 90 top
Q54  2SC2603  [TO92-ECB]  147.32,157.74 90 top
Q55  2SC2603  [TO92-ECB]  136.84,156.47 270 top
Q56  2SC2603  [TO92-ECB]  166.37,197.43 90 top
Q57  2SC2603  [TO92-ECB]  148.59,188.54 0 top
Q58  2SC2603  [TO92-ECB]  142.24,188.54 90 top
Q59  2SC2603  [TO92-ECB]  125.09,198.06 90 top
Q60  2SA1115  [TO92-ECB-PNP]  167.64,182.5 180 top
Q61  2SC2603  [TO92-ECB]  155.57,181.55 90 top
Q62  2SA1115  [TO92-ECB-PNP]  137.16,182.19 180 top
Q63  2SC2603  [TO92-ECB]  136.53,206.95 90 top
Q64  2SA1115  [TO92-ECB-PNP]  145.73,208.86 90 top
Q65  2SC2603  [TO92-ECB]  129.54,224.73 270 top
Q66  2N3906  [TO92-EBC-SMALL]  58.42,29.15 90 top
Q68  [SIP-5]  77.47,276.8 270 top
Q69  2SC2603  [TO92-ECB]  73.66,278.07 270 top
Q70  [SIP-5]  96.84,271.72 0 top
Q71  2SC2603  [TO92-ECB]  97.79,266.64 0 top
Q72  2SC2603  [TO92-ECB]  105.73,161.23 0 top
Q73  2SA1115  [TO92-ECB-PNP]  105.73,171.39 180 top
Q74  2SC2603  [TO92-ECB]  96.52,184.73 180 top
Q75  2SC2603  [TO92-ECB]  46.99,206.95 90 top
Q76  2SC2603  [TO92-ECB]  24.29,206.95 90 top
Q77  2SC2603  [TO92-ECB]  46.99,196.79 90 top
Q78  2SC2603  [TO92-ECB]  24.13,196.79 90 top
Q79  2SA1115  [TO92-ECB-PNP]  8.89,135.83 0 top
Q80  2SC2603  [TO92-ECB]  92.71,229.81 90 top
Q81  2SC2603  [TO92-ECB]  69.22,229.81 90 top
Q82  2SC2878  [TO92-ECB]  6.35,97.73 180 top
Q83  2SC2878  [TO92-ECB]  6.35,106.62 180 top
Q84  [SIP-5]  106.52,214.89 0 top
Q86  2SC2603  [TO92-ECB]  160.02,274.26 0 top
R1  22K  [0207/7]  365.76,158.06 90 top
R2  10K  [0207/7]  363.22,158.06 90 top
R3  100K  [0207/7]  353.06,157.74 90 top
R4  47K  [0207/7]  350.52,157.74 270 top
R5  100K  [0207/7]  344.17,158.06 270 top
R6  22K  [0207/7]  341.63,158.06 270 top
R7  100K  [0207/7]  331.47,156.79 90 top
R8  10K  [0207/7]  326.23,156.79 270 top
R9  4.7K  [0207/7]  323.85,158.06 90 top
R10  12K  [0207/7]  321.31,158.06 90 top
R11  4.7K  [0207/7]  360.68,168.22 270 top
R12  100K  [0207/7]  350.52,168.22 90 top
R12A  1K  [0207/7]  240.35,223.46 270 top
R13  47K  [0207/7]  347.98,168.22 90 top
R14  22K  [0207/7]  340.36,168.22 90 top
R15  100K  [0207/7]  335.28,168.53 270 top
R16  39K  [0207/7]  332.74,168.53 90 top
R17  470K  [0207/7]  360.68,180.92 90 top
R18  470K  [0207/7]  358.14,183.46 90 top
R19  2.2K  [0207/7]  358.14,173.3 270 top
R20  6.8K  [0207/7]  355.6,183.46 90 top
R21  2.2K  [0207/7]  353.06,183.46 270 top
R22  10K  [0207/7]  346.71,185.05 0 top
R23  100K  [0207/7]  341,186 90 top
R24  22K  [0207/7]  342.58,175.84 90 top
R25  100K  [0207/7]  318.13,186 90 top
R26  330K  [0207/7]  334.01,184.09 0 top
R27  1.5M  [0207/7]  334.01,186.63 180 top
R28  150K  [0207/7]  326.39,185.05 90 top
R29  100K  [0207/7]  328.93,178.38 270 top
R30  100K  [0207/7]  325.12,170.76 270 top
R31  100K  [0207/7]  323.85,182.82 270 top
R32  47K  [0207/7]  358.14,189.81 0 top
R33  1M  [0207/7]  358.14,192.35 0 top
R34  100K  [0207/7]  354.33,197.43 180 top
R35  1.8K  [0207/7]  347.66,191.08 90 top
R36  47K  [0207/7]  337.82,192.03 0 top
R37  10K  [0207/7]  332.74,238.07 90 top
R38  4.7K  [0207/7]  335.28,238.07 270 top
R39  1M  [0207/7]  354.33,199.65 0 top
R40  0  [0207/7]  87.31,22.17 90 top
R41  22K  [0207/7]  362.58,206.32 90 top
R42  470K  [0207/7]  356.24,206.32 270 top
R43  47R  [0207/7]  335.6,219.02 90 top
R44  22K  [0207/7]  347.35,206.32 270 top
R45  4.7K  [0207/7]  344.81,206.32 270 top
R46  4.7K  [0207/7]  342.26,206.32 270 top
R47  330K  [0207/7]  318.77,206.95 270 top
R48  22K  [0207/7]  321.31,206.95 270 top
R49  100K  [0207/7]  343.54,197.75 180 top
R50  47K  [0207/7]  343.54,199.97 180 top
R51  2.2K  [0207/7]  333.38,203.78 0 top
R52  10K  [0207/7]  323.85,206.95 270 top
R53  2.2K  [0207/7]  333.06,219.02 270 top
R54  470K  [0207/7]  328.3,221.88 90 top
R55  47R  [0207/7]  342.9,230.45 0 top
R56  330R  [0207/7]  349.88,206.32 270 top
R57  22K  [0207/7]  349.25,229.18 270 top
R58  47K  [0207/7]  330.52,219.02 90 top
R59  47K  [0207/7]  330.2,197.75 0 top
R60  2.2M  [0207/7]  313.69,166.31 270 top
R61  470K  [0207/7]  311.15,166.31 270 top
R62  10K  [0207/7]  303.53,152.34 0 top
R63  100K  [0207/7]  304.8,154.88 0 top
R64  100K  [0207/7]  303.53,161.23 90 top
R65  1K  [0207/7]  300.99,161.23 90 top
R66  100K  [0207/7]  303.53,171.39 270 top
R67  100K  [0207/7]  298.45,171.39 270 top
R68  1K  [0207/7]  311.15,176.47 90 top
R69  100K  [0207/7]  300.67,177.74 0 top
R70  100K  [0207/7]  295.91,171.39 90 top
R71  10K  [0207/7]  290.83,157.42 90 top
R72  1M  [0207/7]  283.21,158.69 90 top
R73  47K  [0207/7]  280.67,158.69 90 top
R74  1M  [0207/7]  278.13,158.69 90 top
R75  47K  [0207/7]  284.48,176.47 180 top
R76  1M  [0207/7]  267.97,158.69 90 top
R77  10K  [0207/7]  270.51,158.69 90 top
R78  47K  [0207/7]  269.88,168.85 270 top
R79  100K  [0207/7]  271.78,175.2 0 top
R80  100K  [0207/7]  271.78,180.28 180 top
R81  100K  [0207/7]  271.78,177.74 0 top
R82  100K  [0207/7]  261.62,174.57 90 top
R83  100K  [0207/7]  284.48,179.01 180 top
R84  10K  [0207/7]  258.44,154.88 90 top
R85  100K  [0207/7]  259.08,166 270 top
R86  100K  [0207/7]  259.08,174.88 270 top
R87  100K  [0207/7]  252.09,170.12 90 top
R88  10K  [0207/7]  249.56,170.12 90 top
R89  10K  [0207/7]  247.01,172.03 90 top
R90  10K  [0207/7]  304.8,185.36 90 top
R91  100R  [0207/7]  298.45,181.55 0 top
R92  22K  [0207/7]  298.45,189.17 0 top
R93  22K  [0207/7]  292.1,185.36 90 top
R94  10K  [0207/7]  289.56,185.36 270 top
R95  100K  [0207/7]  278.13,182.82 0 top
R96  100R  [0207/7]  268.29,182.82 0 top
R97  100K  [0207/7]  267.97,189.17 0 top
R98  47R  [0207/7]  274.32,195.52 90 top
R99  47R  [0207/7]  279.4,189.17 180 top
R100  100K  [0207/7]  307.34,201.87 180 top
R101  1M  [0207/7]  300.99,200.6 90 top
R102  1K  [0207/7]  292.1,200.6 90 top
R103  10K  [0207/7]  289.56,200.6 90 top
R104  2.2K  [0207/7]  287.02,200.6 270 top
R105  10K  [0207/7]  284.48,200.6 90 top
R106  2.2K  [0207/7]  281.94,200.6 270 top
R107  470K  [0207/7]  279.4,200.6 90 top
R108  220K  [0207/7]  276.86,200.6 90 top
R109  220K  [0207/7]  271.78,200.6 90 top
R110  470K  [0207/7]  261.62,206.95 0 top
R111  56K  [0207/7]  261.62,209.49 0 top
R112  10K  [0207/7]  256.54,228.54 0 top
R113  68K  [0207/7]  256.54,231.08 0 top
R114  22K  [0207/7]  248.92,187.9 90 top
R115  47R  [0207/7]  254,188.22 90 top
R116  2.2K  [0207/7]  251.46,186.63 270 top
R117  10K  [0207/7]  250.19,180.92 180 top
R118  220K  [0207/7]  259.08,194.57 90 top
R119  10K  [0207/7]  259.08,185.36 90 top
R120  4.7K  [0207/7]  256.54,188.22 270 top
R121  2.2M  [0207/7]  237.81,223.46 270 top
R122  470K  [0207/7]  238.76,213.3 270 top
R123  10K  [0207/7]  228.6,213.3 270 top
R124  100K  [0207/7]  227.65,200.6 90 top
R125  100K  [0207/7]  227.65,223.46 90 top
R126  1K  [0207/7]  225.11,223.46 90 top
R127  100K  [0207/7]  235.27,223.46 90 top
R128  100K  [0207/7]  240.35,200.6 270 top
R129  470K  [0207/7]  221.93,166.95 270 top
R130  100K  [0207/7]  237.81,200.6 90 top
R131  100K  [0207/7]  235.27,200.6 270 top
R132  10K  [0207/7]  225.11,200.6 90 top
R133  1M  [0207/7]  226.06,213.3 90 top
R134  47K  [0207/7]  221.3,200.6 270 top
R135  1M  [0207/7]  217.17,186 0 top
R136  47K  [0207/7]  225.11,190.44 90 top
R137  1M  [0207/7]  218.76,199.33 90 top
R138  10K  [0207/7]  225.11,177.11 90 top
R139  47K  [0207/7]  214.63,183.46 180 top
R140  100K  [0207/7]  241.3,177.74 270 top
R141  100K  [0207/7]  236.22,177.74 270 top
R142  100K  [0207/7]  238.76,177.74 90 top
R143  100K  [0207/7]  227.65,177.11 90 top
R144  100K  [0207/7]  243.84,190.44 270 top
R145  10K  [0207/7]  236.22,190.44 90 top
R146  100K  [0207/7]  238.76,190.44 90 top
R147  100K  [0207/7]  241.3,190.44 90 top
R148  100K  [0207/7]  232.73,191.08 90 top
R149  10K  [0207/7]  230.19,190.44 90 top
R150  10K  [0207/7]  232.73,177.11 90 top
R151  10K  [0207/7]  208.28,173.93 0 top
R152  100R  [0207/7]  208.28,171.39 0 top
R153  22K  [0207/7]  208.28,168.85 180 top
R154  22K  [0207/7]  208.44,179.65 180 top
R155  10K  [0207/7]  208.44,177.11 0 top
R156  100K  [0207/7]  198.12,182.82 0 top
R157  100R  [0207/7]  198.12,177.74 0 top
R158  100K  [0207/7]  198.12,190.44 0 top
R159  47R  [0207/7]  198.12,227.27 90 top
R160  47R  [0207/7]  191.77,203.14 180 top
R161  100K  [0207/7]  191.77,206.95 180 top
R162  1M  [0207/7]  204.47,214.57 0 top
R163  1K  [0207/7]  204.47,212.03 180 top
R164  10K  [0207/7]  198.12,215.84 270 top
R165  2.2K  [0207/7]  204.47,231.08 180 top
R166  10K  [0207/7]  191.77,198.06 180 top
R167  2.2K  [0207/7]  191.77,200.6 0 top
R168  470K  [0207/7]  191.77,226 180 top
R169  220K  [0207/7]  191.77,223.46 180 top
R170  220K  [0207/7]  191.77,209.49 180 top
R171  56K  [0207/7]  200.98,201.56 270 top
R172  68K  [0207/7]  215.9,231.08 0 top
R173  10K  [0207/7]  215.9,228.54 0 top
R175  47R  [0207/7]  235.59,167.58 270 top
R176  2.2K  [0207/7]  232.09,167.58 90 top
R177  22K  [0207/7]  229.55,167.58 270 top
R178  220K  [0207/7]  198.12,180.28 0 top
R179  10K  [0207/7]  198.12,171.39 180 top
R180  4.7K  [0207/7]  199.07,167.9 0 top
R181  10K  [0207/7]  238.12,167.58 90 top
R182  10K  [0207/7]  215.9,267.28 270 top
R183  10K  [0207/7]  210.82,267.28 90 top
R184  10K  [0207/7]  196.85,278.07 270 top
R185  33K  [0207/7]  195.58,268.23 90 top
R186  100K  [0207/7]  210.82,276.8 90 top
R187  47K  [0207/7]  215.9,276.8 90 top
R188  100K  [0207/7]  19.05,271.72 180 top
R189  100K  [0207/7]  8.57,165.04 180 top
R190  22K  [0207/7]  232.09,261.88 180 top
R191  10K  [0207/7]  224.79,253.31 180 top
R192  220K  [0207/7]  224.79,255.85 0 top
R193  22K  [0207/7]  214.63,255.85 180 top
R194  100K  [0207/7]  214.63,253.31 0 top
R195  1K  [0207/7]  204.47,250.13 0 top
R196  22K  [0207/7]  228.92,247.59 90 top
R197  10K  [0207/7]  231.46,247.91 270 top
R198  100K  [0207/7]  218.44,250.45 0 top
R199  47R  [0207/7]  204.47,247.59 180 top
R200  100K  [0207/7]  218.44,247.91 180 top
R201  1K  [0207/7]  173.99,252.67 90 top
R202  39K  [0207/7]  171.45,252.67 270 top
R203  47R  [0207/7]  113.03,252.67 90 top
R204  1K  [0207/7]  107.95,252.67 270 top
R205  3.3K  [0207/7]  110.49,252.67 90 top
R206  4.7K  [0207/7]  127,278.07 270 top
R207  150K  [0207/7]  111.76,262.83 270 top
R208  47K  [0207/7]  125.41,264.74 90 top
R209  10K  [0207/7]  119.7,264.74 270 top
R210  22K  [0207/7]  115.57,278.07 270 top
R211  10K  [0207/7]  129.54,278.07 90 top
R212  10K  [0207/7]  124.46,278.07 90 top
R213  22K  [0207/7]  118.11,278.07 90 top
R214  4.7K  [0207/7]  135.89,262.83 180 top
R215  22K  [0207/7]  106.68,278.07 90 top
R216  10K  [0207/7]  109.22,278.07 270 top
R217  4.7K  [0207/7]  135.89,260.29 0 top
R218  22K  [0207/7]  135.89,265.37 180 top
R219  4.7K  [0207/7]  136.84,256.8 0 top
R220  82K  [0207/7]  135.89,272.99 180 top
R221  18K  [0207/7]  160.02,267.91 0 top
R222  10K  [0207/7]  160.02,270.45 180 top
R223  330R  [0207/7]  135.89,280.61 180 top
R224  470K  [0207/7]  166.37,274.26 270 top
R225  1M  [0207/7]  135.89,278.07 180 top
R226  68K  [0207/7]  160.02,262.83 0 top
R227  2.7K  [0207/7]  160.02,260.29 180 top
R228  5.6K  [0207/7]  160.02,256.8 180 top
R229  1M  [0207/7]  135.89,270.45 180 top
R230  2.2K  [0207/7]  173.99,266.96 270 top
R233  470K  [0207/7]  123.19,252.67 90 top
R234  470K  [0207/7]  120.65,252.67 270 top
R235  15K  [0207/7]  171.45,274.26 270 top
R236  1K  [0207/7]  168.91,252.67 270 top
R237  82K  [0207/7]  181.61,252.67 270 top
R238  15K  [0207/7]  168.91,274.26 270 top
R239  22K  [0207/7]  315.91,229.18 270 top
R240  4.7K  [0207/7]  310.83,238.7 270 top
R241  10K  [0207/7]  309.88,232.35 0 top
R242  10K  [0207/7]  311.15,245.05 0 top
R243  10K  [0207/7]  298.77,232.35 180 top
R244  10K  [0207/7]  330.2,252.67 180 top
R245  100R  [0207/7]  330.2,255.21 180 top
R246  22K  [0207/7]  330.2,250.13 0 top
R247  47K  [0207/7]  353.06,267.91 90 top
R248  470K  [0207/7]  353.06,278.07 270 top
R249  100K  [0207/7]  345.44,266.64 90 top
R250  1K  [0207/7]  345.44,276.8 90 top
R251  100K  [0207/7]  339.09,278.07 180 top
R252  100K  [0207/7]  329.25,278.07 0 top
R253  1K  [0207/7]  329.25,274.9 0 top
R254  100K  [0207/7]  289.56,224.73 90 top
R255  100K  [0207/7]  292.1,224.73 90 top
R256  1M  [0207/7]  290.83,214.25 180 top
R257  100K  [0207/7]  289.56,231.08 0 top
R258  1M  [0207/7]  330.2,257.75 0 top
R259  100K  [0207/7]  330.2,260.29 180 top
R260  100K  [0207/7]  318.77,278.07 270 top
R261  47K  [0207/7]  321.31,267.91 90 top
R262  100K  [0207/7]  318.77,267.91 270 top
R263  10K  [0207/7]  318.77,257.75 270 top
R264  47K  [0207/7]  312.42,255.21 0 top
R265  22K  [0207/7]  269.24,228.23 180 top
R266  100K  [0207/7]  268.92,231.08 0 top
R267  1M  [0207/7]  300.99,252.67 0 top
R268  10K  [0207/7]  294.64,260.29 270 top
R269  100K  [0207/7]  311.15,274.26 90 top
R270  100K  [0207/7]  306.07,272.99 90 top
R271  100K  [0207/7]  303.53,269.18 270 top
R272  100K  [0207/7]  303.53,278.07 270 top
R273  100K  [0207/7]  295.91,275.21 90 top
R274  10K  [0207/7]  293.37,275.21 90 top
R275  10K  [0207/7]  289.56,275.21 90 top
R276  6.8K  [0207/7]  282.57,278.07 270 top
R277  47K  [0207/7]  280.04,278.07 90 top
R278  2.2K  [0207/7]  284.48,270.77 90 top
R279  47R  [0207/7]  287.02,270.77 270 top
R280  220K  [0207/7]  281.94,262.83 90 top
R281  100K  [0207/7]  300.99,250.13 180 top
R282  22K  [0207/7]  294.32,250.13 90 top
R283  10K  [0207/7]  300.99,255.21 0 top
R284  10K  [0207/7]  308.29,238.7 270 top
R285  3.3K  [0207/7]  244.16,278.07 270 top
R286  10K  [0207/7]  279.4,210.13 0 top
R287  100K  [0207/7]  309.88,225.37 0 top
R288  1.5K  [0207/7]  280.67,251.4 90 top
R289  47R  [0207/7]  277.81,251.4 270 top
R290  22K  [0207/7]  287.97,237.43 270 top
R291  220K  [0207/7]  266.7,246.64 90 top
R292  100K  [0207/7]  264.16,256.48 90 top
R293  220K  [0207/7]  261.62,256.48 270 top
R294  47K  [0207/7]  255.27,264.1 270 top
R295  220K  [0207/7]  257.81,267.28 270 top
R296  22K  [0207/7]  268.61,267.91 180 top
R297  220K  [0207/7]  267.97,278.07 90 top
R298  47R  [0207/7]  262.89,270.77 90 top
R299  4.7K  [0207/7]  257.81,278.07 90 top
R300  22K  [0207/7]  249.24,278.07 270 top
R301  22K  [0207/7]  246.7,278.07 90 top
R302  220K  [0207/7]  245.11,267.91 90 top
R303  47R  [0207/7]  242.57,267.91 270 top
R304  2.2K  [0207/7]  247.97,259.02 270 top
R305  10K  [0207/7]  248.92,252.04 0 top
R314  5.6K  [0207/7]  116.84,29.15 270 top
R315  220  [0207/7]  85.09,29.15 270 top
R316  220  [0207/7]  111.76,29.15 270 top
R317  220  [0207/7]  134.62,29.15 270 top
R318  220  [0207/7]  80.01,29.15 270 top
R319  220  [0207/7]  82.55,29.15 270 top
R326  2.2K  [0207/7]  69.85,29.15 270 top
R327  2.2K  [0207/7]  77.47,29.15 90 top
R328  100K  [0207/7]  72.39,29.15 90 top
R329  1M  [0207/7]  150.5,156.63 90 top
R330  100K  [0207/7]  74.93,29.15 90 top
R331  2.2M  [0207/7]  199.07,158.38 270 top
R332  470K  [0207/7]  188.91,158.38 270 top
R333  1K  [0207/7]  192.72,164.09 0 top
R334  100K  [0207/7]  177.48,175.2 0 top
R335  100K  [0207/7]  182.88,166.63 270 top
R336  100K  [0207/7]  177.8,166.63 270 top
R337  100K  [0207/7]  182.56,156.47 90 top
R338  1K  [0207/7]  180.02,156.47 90 top
R339  100K  [0207/7]  172.72,166.63 90 top
R340  10K  [0207/7]  178.12,172.66 180 top
R341  100K  [0207/7]  176.53,197.43 180 top
R342  10K  [0207/7]  173.99,180.92 90 top
R343  100R  [0207/7]  167.64,178.06 0 top
R344  22K  [0207/7]  167.64,185.68 0 top
R345  22K  [0207/7]  161.29,181.24 90 top
R346  10K  [0207/7]  158.75,181.24 270 top
R347  100K  [0207/7]  146.37,181.24 90 top
R348  100R  [0207/7]  137.48,178.38 0 top
R349  100K  [0207/7]  137.16,184.73 0 top
R350  47R  [0207/7]  148.91,181.24 90 top
R351  47R  [0207/7]  151.45,181.24 90 top
R352  220K  [0207/7]  143.51,196.16 90 top
R353  220K  [0207/7]  146.05,195.84 90 top
R354  470K  [0207/7]  148.59,196.16 90 top
R355  2.2K  [0207/7]  151.13,196.16 270 top
R356  10K  [0207/7]  153.67,196.16 90 top
R357  2.2K  [0207/7]  156.21,196.16 270 top
R358  10K  [0207/7]  158.75,196.16 90 top
R359  1K  [0207/7]  161.29,196.16 90 top
R360  1M  [0207/7]  170.18,196.16 90 top
R361  10K  [0207/7]  166.37,156.79 90 top
R362  100K  [0207/7]  175.26,166.63 90 top
R363  1M  [0207/7]  159.38,156.79 90 top
R364  47K  [0207/7]  155.89,156.79 90 top
R365  1.2K  [0207/7]  114.3,29.15 90 top
R366  47K  [0207/7]  143.51,166.31 270 top
R367  10K  [0207/7]  143.51,156.47 90 top
R368  47K  [0207/7]  140.97,166.31 270 top
R369  100K  [0207/7]  138.43,166.31 270 top
R370  100K  [0207/7]  141.29,175.2 180 top
R371  100K  [0207/7]  141.29,172.66 0 top
R372  100K  [0207/7]  128.27,170.44 270 top
R373  100K  [0207/7]  130.81,170.12 90 top
R374  100K  [0207/7]  153.67,173.62 180 top
R375  100K  [0207/7]  128.27,161.55 270 top
R376  10K  [0207/7]  129.22,154.25 0 top
R377  1M  [0207/7]  140.97,156.47 90 top
R378  470K  [0207/7]  131.76,198.06 0 top
R379  47R  [0207/7]  123.19,183.78 90 top
R380  2.2K  [0207/7]  120.65,183.78 270 top
R381  220K  [0207/7]  127.95,189.81 90 top
R382  10K  [0207/7]  128.27,180.6 90 top
R383  4.7K  [0207/7]  125.73,183.78 270 top
R384  10K  [0207/7]  176.53,210.45 0 top
R385  56K  [0207/7]  176.53,207.91 180 top
R386  68K  [0207/7]  163.51,174.25 0 top
R387  22K  [0207/7]  118.11,183.78 90 top
R388  10K  [0207/7]  120.33,176.79 180 top
R389  100K  [0207/7]  121.28,165.68 90 top
R390  10K  [0207/7]  118.75,165.68 90 top
R391  10K  [0207/7]  116.2,167.58 90 top
R394  2.2K  [0207/7]  170.18,208.22 90 top
R395  22K  [0207/7]  162.56,234.58 180 top
R396  22K  [0207/7]  135.25,214.57 90 top
R397  4.7K  [0207/7]  153.67,210.76 270 top
R398  10K  [0207/7]  130.18,208.22 90 top
R399  22K  [0207/7]  132.72,208.22 270 top
R400  47K  [0207/7]  141.6,208.22 90 top
R401  2.7K  [0207/7]  144.78,217.11 0 top
R402  1M  [0207/7]  151.13,210.76 270 top
R403  1M  [0207/7]  133.35,224.73 90 top
R404  2.2K  [0207/7]  160.97,224.73 90 top
R406  10K  [0207/7]  148.59,210.76 270 top
R407  470K  [0207/7]  166.37,210.76 270 top
R408  12K  [0207/7]  158.75,211.72 90 top
R411  2.2K  [0207/7]  181.61,229.81 270 top
R414  330K  [0207/7]  167.32,224.73 270 top
R415  12K  [0207/7]  164.78,224.73 270 top
R416  470K  [0207/7]  155.89,224.73 270 top
R417  3.3K  [0207/7]  156.84,218.7 0 top
R418  680R  [0207/7]  146.05,224.73 270 top
R419  4.7K  [0207/7]  135.89,224.73 90 top
R420  220K  [0207/7]  138.43,224.73 90 top
R421  4.7K  [0207/7]  140.97,224.73 90 top
R422  22K  [0207/7]  143.51,224.73 270 top
R423  12K  [0207/7]  148.59,224.73 90 top
R424  47K  [0207/7]  91.44,278.07 270 top
R425  47K  [0207/7]  91.44,265.06 270 top
R426  4.7K  [0207/7]  96.52,253.31 180 top
R427  2.2K  [0207/7]  96.52,250.77 180 top
R428  220R  [0207/7]  97.79,280.61 180 top
R429  100R  [0207/7]  97.79,278.07 180 top
R430  2.2K  [0207/7]  97.79,275.53 0 top
R431  22R  [0207/7]  97.79,262.83 180 top
R432  270K  [0207/7]  97.79,260.29 180 top
R433  220R  [0207/7]  75.56,268.23 90 top
R434  100R  [0207/7]  73.03,269.18 270 top
R435  4.7K  [0207/7]  78.74,265.37 90 top
R436  2.2K  [0207/7]  83.82,278.07 90 top
R437  2.2K  [0207/7]  81.28,278.07 90 top
R438  22R  [0207/7]  69.85,278.07 270 top
R439  470K  [0207/7]  67.31,278.07 90 top
R440  10K  [0207/7]  7.62,239.02 0 top
R441  6.8K  [0207/7]  7.62,236.48 180 top
R442  10K  [0207/7]  34.61,216.48 270 top
R443  6.8K  [0207/7]  40.96,216.8 90 top
R444  22K  [0207/7]  60.96,230.77 270 top
R445  22K  [0207/7]  53.34,228.54 270 top
R446  22K  [0207/7]  28.57,231.08 180 top
R447  22K  [0207/7]  105.73,154.88 180 top
R448  10K  [0207/7]  105.73,157.42 0 top
R449  22K  [0207/7]  105.73,165.04 180 top
R450  10K  [0207/7]  105.73,167.58 0 top
R451  10K  [0207/7]  105.73,175.2 180 top
R452  100K  [0207/7]  60.96,215.53 90 top
R453  220K  [0207/7]  96.52,193.62 180 top
R454  22K  [0207/7]  96.52,190.76 0 top
R455  10K  [0207/7]  96.52,187.9 180 top
R456  5.6K  [0207/7]  54.61,206.95 90 top
R457  5.6K  [0207/7]  49.53,206.95 270 top
R458  10K  [0207/7]  40.64,207.27 270 top
R459  5.6K  [0207/7]  38.1,207.27 90 top
R460  10K  [0207/7]  35.56,207.27 270 top
R461  5.6K  [0207/7]  30.48,207.59 270 top
R462  5.6K  [0207/7]  54.61,196.79 90 top
R463  5.6K  [0207/7]  49.53,196.79 270 top
R464  10K  [0207/7]  40.64,196.48 270 top
R465  5.6K  [0207/7]  38.1,196.48 90 top
R466  10K  [0207/7]  35.56,196.48 270 top
R467  5.6K  [0207/7]  30.48,196.48 270 top
R468  10K  [0207/7]  17.78,134.56 180 top
R469  22K  [0207/7]  6.35,102.81 180 top
R470  22K  [0207/7]  6.35,110.43 180 top
R471  4.7K  [0207/7]  2.54,123.13 270 top
R472  470K  [0207/7]  8.57,131.07 0 top
R473  1K  [0207/7]  6.35,93.92 180 top